# EAGLE design Protoboard (EAGLE 6.5.0)
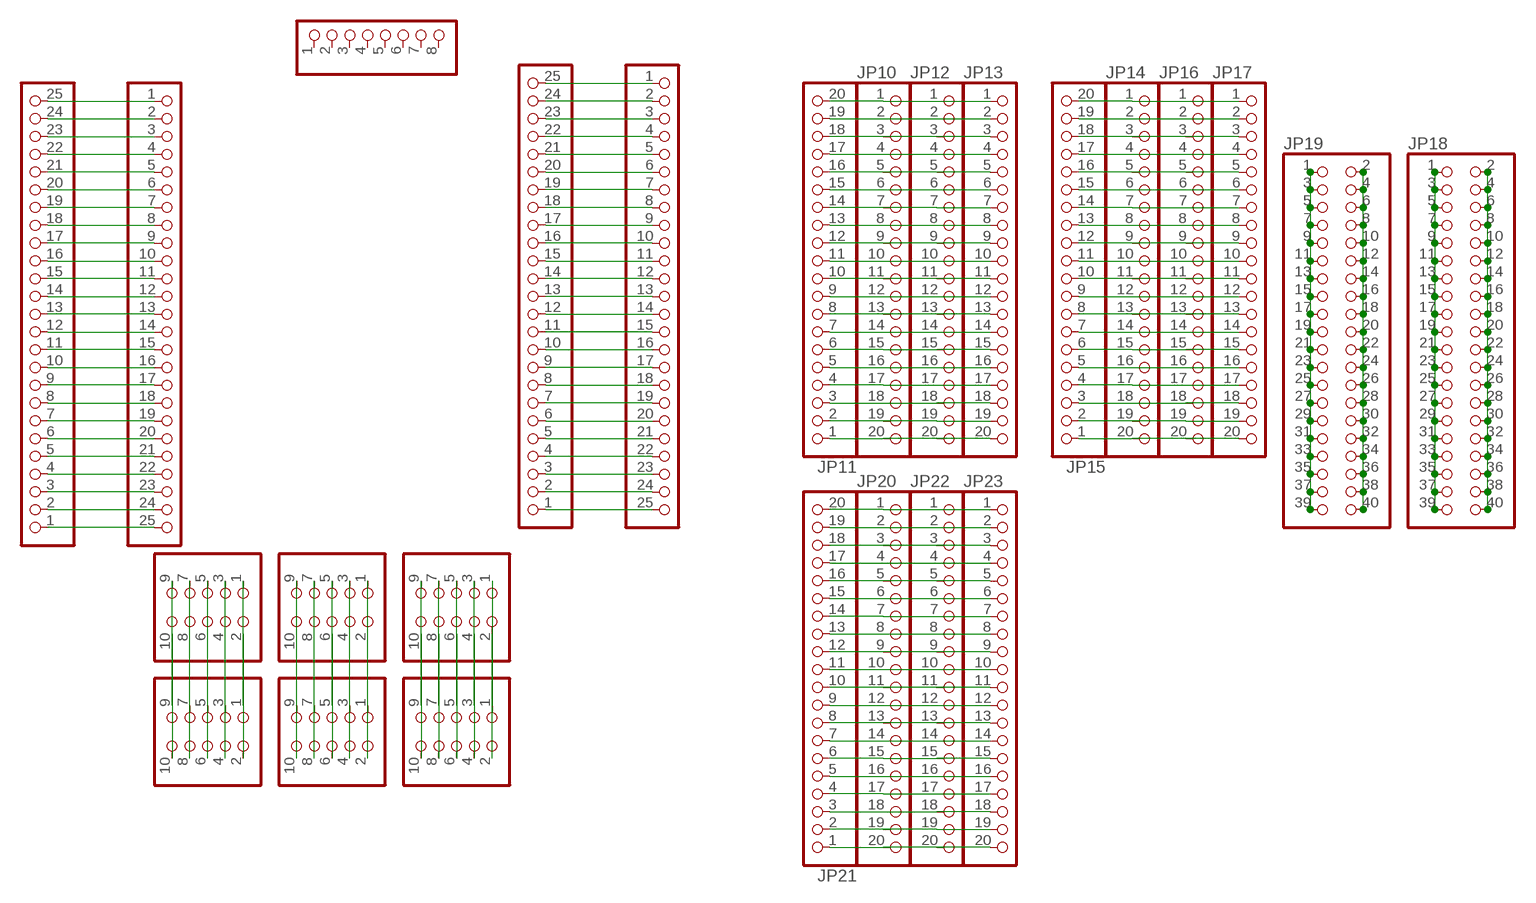
[diagram p0: schematic, sheet 1]

## Parts
GYH  PINHD-1X25  [1X25]
GYH1  PINHD-1X25  [1X25]
JP1  PINHD-1X25  [1X25]
JP2  PINHD-1X25  [1X25]
JP3  PINHD-1X8  [1X08]
JP4  PINHD-2X5/90  [2X05/90]
JP5  PINHD-2X5/90  [2X05/90]
JP6  PINHD-2X5/90  [2X05/90]
JP7  PINHD-2X5  [2X05]
JP8  PINHD-2X5  [2X05]
JP9  PINHD-2X5  [2X05]
JP10  PINHD-1X20  [1X20]
JP11  PINHD-1X20  [1X20]
JP12  PINHD-1X20  [1X20]
JP13  PINHD-1X20  [1X20]
JP14  PINHD-1X20  [1X20]
JP15  PINHD-1X20  [1X20]
JP16  PINHD-1X20  [1X20]
JP17  PINHD-1X20  [1X20]
JP18  PINHD-2X20  [2X20]
JP19  PINHD-2X20  [2X20]
JP20  PINHD-1X20  [1X20]
JP21  PINHD-1X20  [1X20]
JP22  PINHD-1X20  [1X20]
JP23  PINHD-1X20  [1X20]

## Nets
N$1: GYH1.1 GYH.25
N$2: GYH1.2 GYH.24
N$3: GYH1.3 GYH.23
N$4: GYH1.4 GYH.22
N$5: GYH1.5 GYH.21
N$6: GYH1.6 GYH.20
N$7: JP1.25 JP2.1
N$8: JP1.24 JP2.2
N$9: JP1.23 JP2.3
N$10: JP1.22 JP2.4
N$11: JP1.21 JP2.5
N$12: JP1.19 JP2.7
N$13: GYH1.7 GYH.19
N$14: GYH1.8 GYH.18
N$15: GYH1.9 GYH.17
N$16: GYH1.10 GYH.16
N$17: GYH1.11 GYH.15
N$18: GYH1.12 GYH.14
N$19: GYH1.13 GYH.13
N$20: GYH1.14 GYH.12
N$21: GYH1.15 GYH.11
N$22: GYH1.16 GYH.10
N$23: GYH1.17 GYH.9
N$24: GYH1.18 GYH.8
N$25: GYH1.19 GYH.7
N$26: GYH1.20 GYH.6
N$27: GYH1.21 GYH.5
N$28: GYH1.22 GYH.4
N$29: GYH1.23 GYH.3
N$30: GYH1.24 GYH.2
N$31: GYH1.25 GYH.1
N$32: JP1.20 JP2.6
N$33: JP1.18 JP2.8
N$34: JP1.17 JP2.9
N$35: JP1.16 JP2.10
N$36: JP1.15 JP2.11
N$37: JP1.14 JP2.12
N$38: JP1.13 JP2.13
N$39: JP1.12 JP2.14
N$40: JP1.11 JP2.15
N$41: JP1.10 JP2.16
N$42: JP1.9 JP2.17
N$43: JP1.8 JP2.18
N$44: JP1.7 JP2.19
N$45: JP1.6 JP2.20
N$46: JP1.5 JP2.21
N$47: JP1.4 JP2.22
N$48: JP1.3 JP2.23
N$49: JP1.2 JP2.24
N$50: JP1.1 JP2.25
N$51: JP4.1 JP7.1
N$52: JP4.2 JP7.2
N$53: JP4.3 JP7.3
N$54: JP4.4 JP7.4
N$55: JP4.5 JP7.5
N$56: JP4.6 JP7.6
N$57: JP4.7 JP7.7
N$58: JP4.8 JP7.8
N$59: JP4.9 JP7.9
N$60: JP4.10 JP7.10
N$61: JP5.1 JP8.1
N$62: JP5.2 JP8.2
N$63: JP5.3 JP8.3
N$64: JP5.4 JP8.4
N$65: JP5.5 JP8.5
N$66: JP5.6 JP8.6
N$67: JP5.7 JP8.7
N$68: JP5.8 JP8.8
N$69: JP5.9 JP8.9
N$70: JP5.10 JP8.10
N$71: JP6.1 JP9.1
N$72: JP6.2 JP9.2
N$73: JP6.3 JP9.3
N$74: JP6.4 JP9.4
N$75: JP6.5 JP9.5
N$76: JP6.6 JP9.6
N$77: JP6.7 JP9.7
N$78: JP6.8 JP9.8
N$79: JP6.9 JP9.9
N$80: JP6.10 JP9.10
N$81: JP10.1 JP11.20 JP12.1 JP13.1
N$82: JP10.2 JP11.19 JP12.2 JP13.2
N$83: JP10.3 JP11.18 JP12.3 JP13.3
N$84: JP10.4 JP11.17 JP12.4 JP13.4
N$85: JP10.5 JP11.16 JP12.5 JP13.5
N$86: JP10.6 JP11.15 JP12.6 JP13.6
N$87: JP10.7 JP11.14
N$88: JP10.8 JP11.13 JP12.8 JP13.8
N$89: JP10.9 JP11.12 JP12.9 JP13.9
N$90: JP10.10 JP11.11 JP12.10 JP13.10
N$91: JP10.11 JP11.10 JP12.11 JP13.11
N$92: JP10.12 JP11.9 JP12.12 JP13.12
N$93: JP10.13 JP11.8 JP12.13 JP13.13
N$94: JP10.14 JP11.7 JP12.14 JP13.14
N$95: JP10.15 JP11.6 JP12.15 JP13.15
N$96: JP10.16 JP11.5 JP12.16 JP13.16
N$97: JP10.17 JP11.4 JP12.17 JP13.17
N$98: JP10.18 JP11.3 JP12.18 JP13.18
N$99: JP10.19 JP11.2 JP12.19 JP13.19
N$100: JP12.7 JP13.7
N$101: JP14.1 JP15.20 JP16.1 JP17.1
N$102: JP10.20 JP11.1 JP12.20 JP13.20
N$103: JP14.2 JP15.19 JP16.2 JP17.2
N$104: JP14.3 JP15.18 JP16.3 JP17.3
N$105: JP14.4 JP15.17 JP16.4 JP17.4
N$106: JP14.5 JP15.16 JP16.5 JP17.5
N$107: JP14.6 JP15.15 JP16.6 JP17.6
N$108: JP14.7 JP15.14 JP16.7 JP17.7
N$109: JP14.8 JP15.13 JP16.8 JP17.8
N$110: JP14.9 JP15.12 JP16.9 JP17.9
N$111: JP14.10 JP15.11 JP16.10 JP17.10
N$112: JP14.11 JP15.10 JP16.11 JP17.11
N$113: JP14.12 JP15.9 JP16.12 JP17.12
N$114: JP14.13 JP15.8 JP16.13 JP17.13
N$115: JP14.14 JP15.7 JP16.14 JP17.14
N$116: JP14.15 JP15.6 JP16.15 JP17.15
N$117: JP14.16 JP15.5 JP16.16 JP17.16
N$118: JP14.17 JP15.4 JP16.17 JP17.17
N$119: JP14.18 JP15.3 JP16.18 JP17.18
N$120: JP14.19 JP15.2 JP16.19 JP17.19
N$121: JP14.20 JP15.1 JP16.20 JP17.20
N$122: JP18.1 JP18.3 JP18.5 JP18.7 JP18.9 JP18.11 JP18.13 JP18.15 JP18.17 JP18.19 JP18.21 JP18.23 JP18.25 JP18.27 JP18.29 JP18.31 JP18.33 JP18.35 JP18.37 JP18.39
N$123: JP18.2 JP18.4 JP18.6 JP18.8 JP18.10 JP18.12 JP18.14 JP18.16 JP18.18 JP18.20 JP18.22 JP18.24 JP18.26 JP18.28 JP18.30 JP18.32 JP18.34 JP18.36 JP18.38 JP18.40
N$124: JP19.1 JP19.3 JP19.5 JP19.7 JP19.9 JP19.11 JP19.13 JP19.15 JP19.17 JP19.19 JP19.21 JP19.23 JP19.25 JP19.27 JP19.29 JP19.31 JP19.33 JP19.35 JP19.37 JP19.39
N$125: JP19.2 JP19.4 JP19.6 JP19.8 JP19.10 JP19.12 JP19.14 JP19.16 JP19.18 JP19.20 JP19.22 JP19.24 JP19.26 JP19.28 JP19.30 JP19.32 JP19.34 JP19.36 JP19.38 JP19.40
N$126: JP20.1 JP21.20 JP22.1 JP23.1
N$127: JP20.2 JP21.19 JP22.2 JP23.2
N$128: JP20.3 JP21.18 JP22.3 JP23.3
N$129: JP20.4 JP21.17 JP22.4 JP23.4
N$130: JP20.5 JP21.16 JP22.5 JP23.5
N$131: JP20.6 JP21.15 JP22.6 JP23.6
N$132: JP20.7 JP21.14 JP22.7 JP23.7
N$133: JP20.8 JP21.13 JP22.8 JP23.8
N$134: JP20.9 JP21.12 JP22.9 JP23.9
N$135: JP20.10 JP21.11 JP22.10 JP23.10
N$136: JP20.11 JP21.10 JP22.11 JP23.11
N$137: JP20.12 JP21.9 JP22.12 JP23.12
N$138: JP20.13 JP21.8 JP22.13 JP23.13
N$139: JP20.14 JP21.7 JP22.14 JP23.14
N$140: JP20.15 JP21.6 JP22.15 JP23.15
N$141: JP20.16 JP21.5 JP22.16 JP23.16
N$142: JP20.17 JP21.4 JP22.17 JP23.17
N$143: JP20.18 JP21.3 JP22.18 JP23.18
N$144: JP20.19 JP21.2 JP22.19 JP23.19
N$145: JP20.20 JP21.1 JP22.20 JP23.20
Unconnected: JP3.1 JP3.2 JP3.3 JP3.4 JP3.5 JP3.6 JP3.7 JP3.8

## Library data of the parts
GYH GYH1 JP1 JP2 = pinhead:PINHD-1X25: PIN HEADER
JP3 = pinhead:PINHD-1X8: PIN HEADER
JP4-JP9 = pinhead:PINHD-2X5: PIN HEADER
JP10-JP17 JP20-JP23 = pinhead:PINHD-1X20: PIN HEADER
JP18 JP19 = pinhead:PINHD-2X20: PIN HEADER

## Board
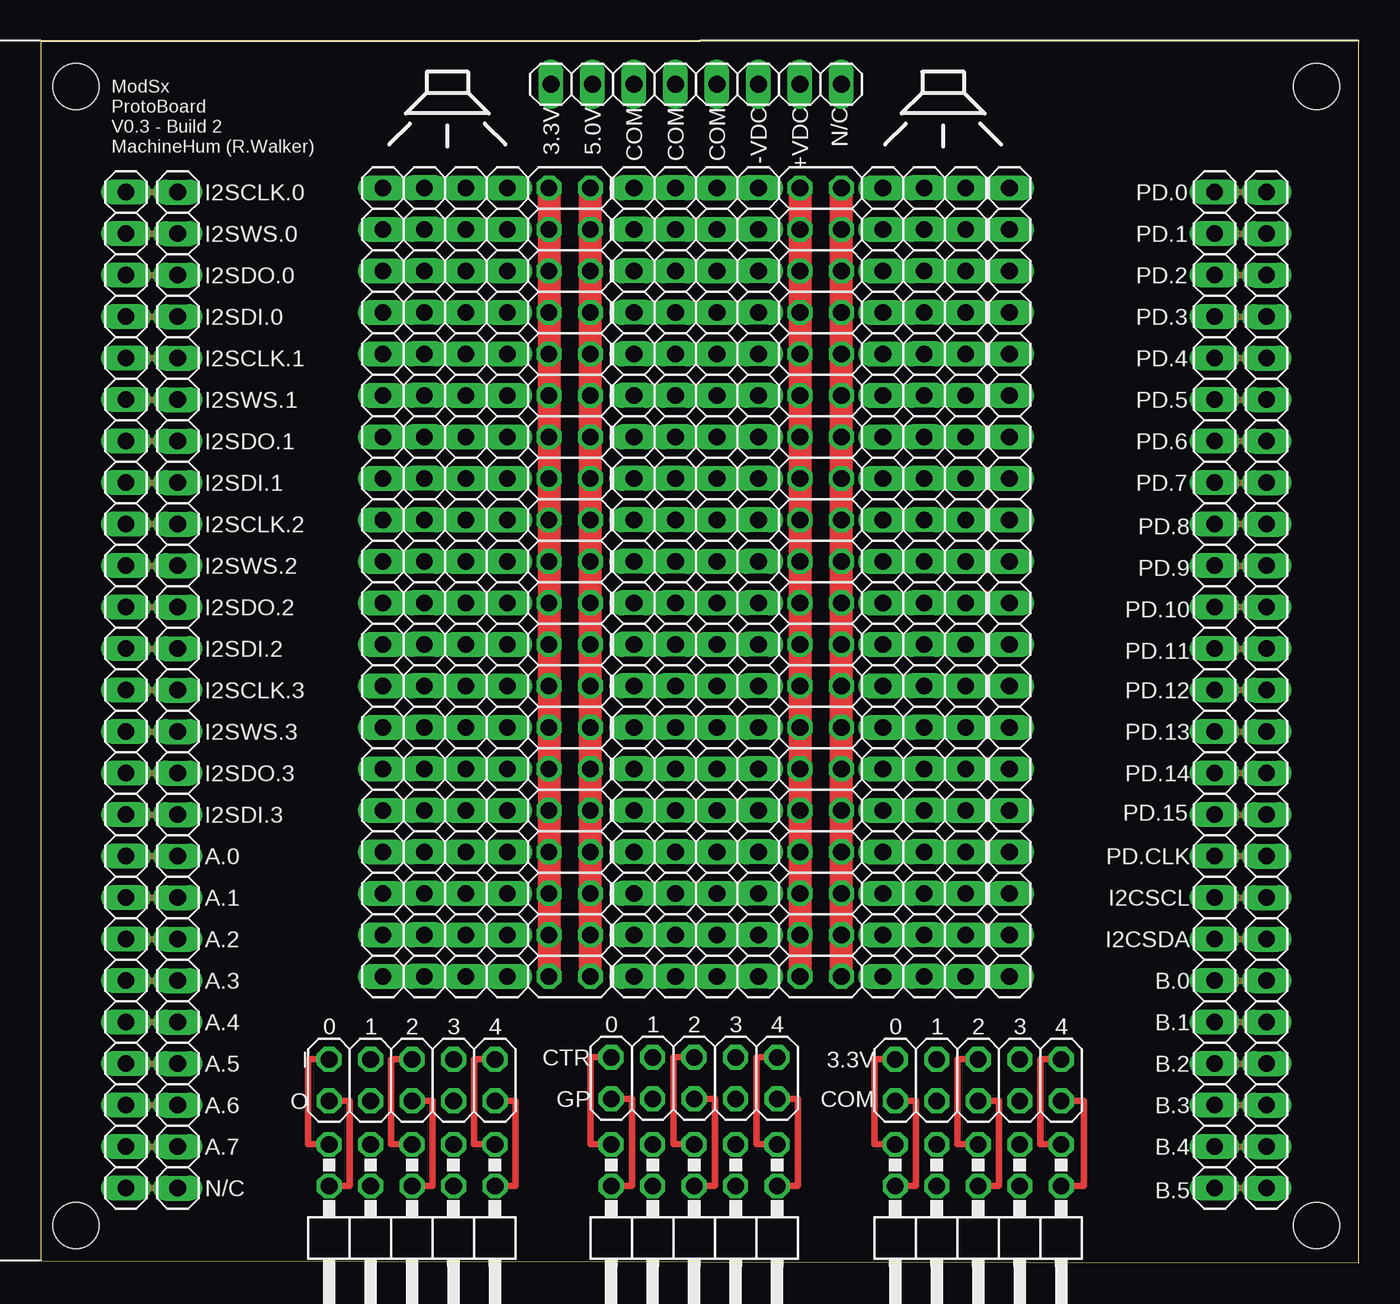
[diagram p1: board, top side]
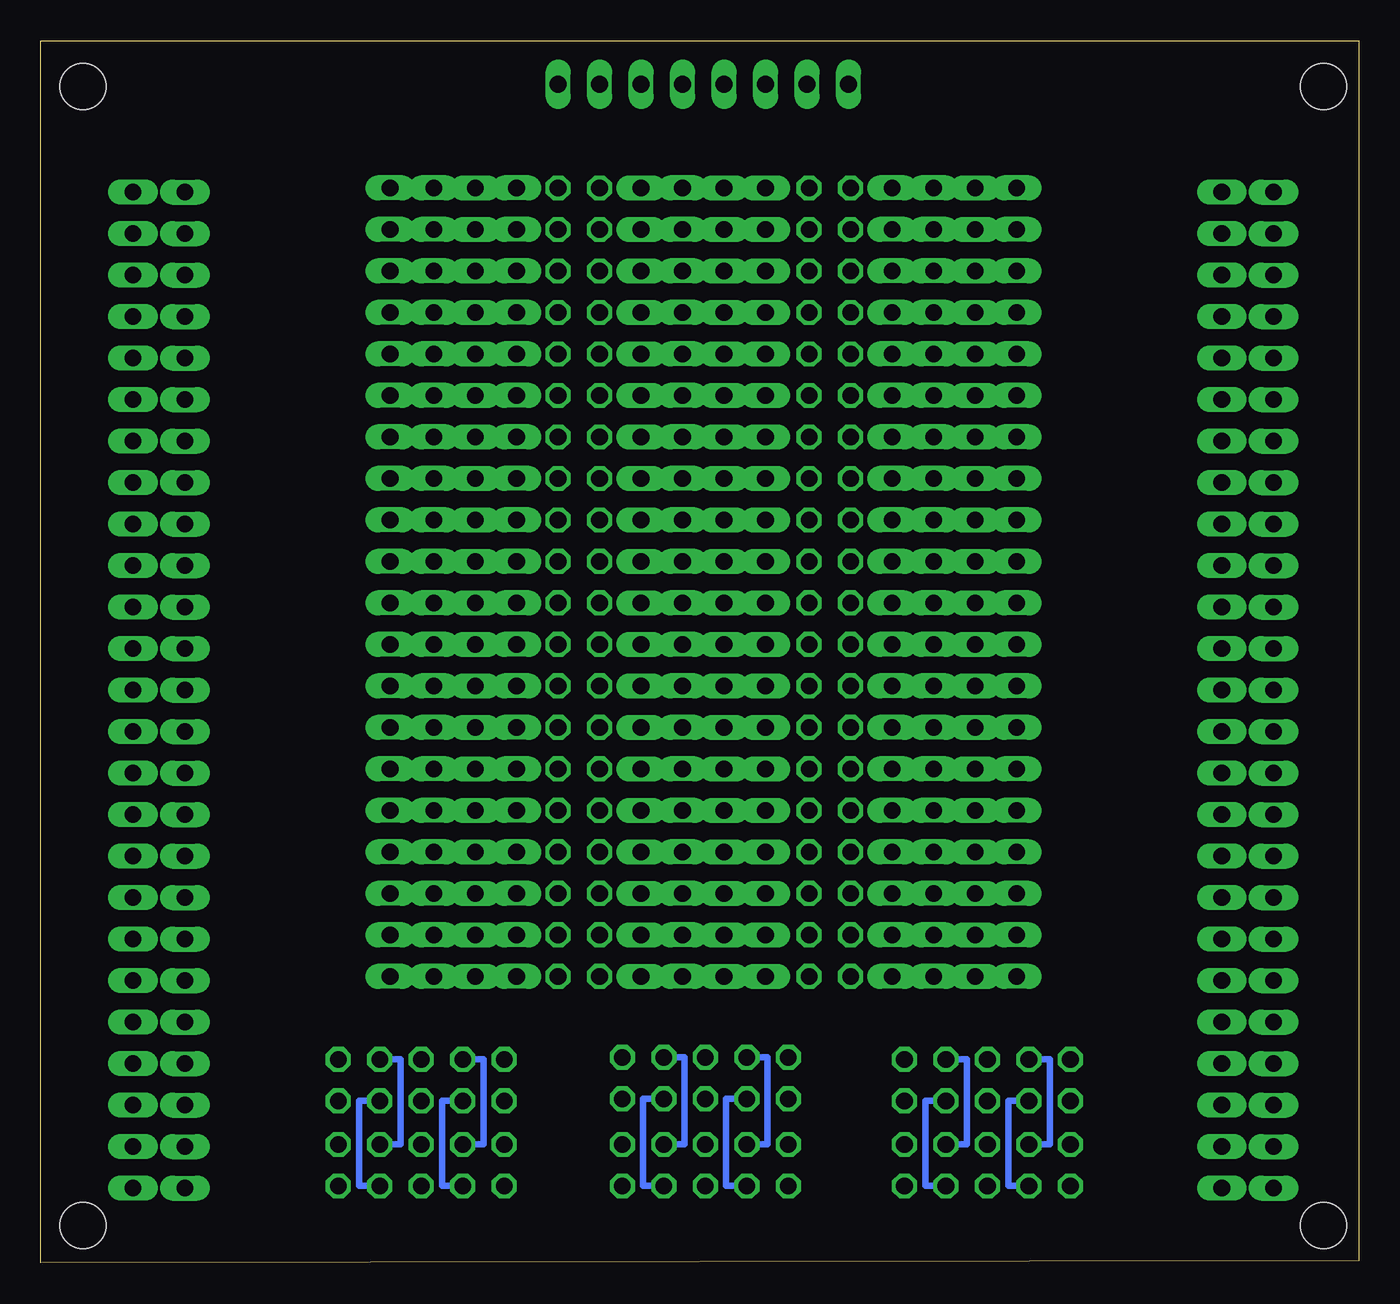
[diagram p2: board, bottom side, seen from below]

Size 80.7 x 74.79 mm. Coordinates in mm from the lower left corner, seen from the top.
Outline: 0,0.13 80.7,0 80.7,74.79 0,74.79 0,0.13
Copper layers (1*16): Top 0.035mm / dielectric 1.5mm / Bottom 0.035mm
Design rules "default": minimum track width 10mil, minimum drill 24mil, track to track 8mil, track to pad 8mil, pad to pad 8mil, via to via 8mil, smd to smd 8mil, copper to edge 40mil, drill to drill 8mil, minimum pad ring 10mil, minimum via ring 8mil, stop-mask expansion 4mil, vias tented up to drill 0mil, thermal gap 10mil
Holes 2.8 mm at 2.16,72.01 2.16,2.29 78.11,72.01 78.11,2.29

### Footprints (pad centres in the part's own frame; a part is rotated, then mirrored left to right if it is on the bottom)
1X25 = drill 1.016 long: 1 -29.21,0; 2 -26.67,0; 3 -24.13,0; 4 -21.59,0; 5 -19.05,0; 6 -16.51,0; 7 -13.97,0; 8 -11.43,0; 9 -8.89,0; 10 -6.35,0; 11 -3.81,0; 12 -1.27,0; 13 1.27,0; 14 3.81,0; 15 6.35,0; 16 8.89,0; 17 11.43,0; 18 13.97,0; 19 16.51,0; 20 19.05,0; 21 21.59,0; 22 24.13,0; 23 26.67,0; 24 29.21,0; 25 31.75,0
1X08 = drill 1.016 long: 1 -8.89,0; 2 -6.35,0; 3 -3.81,0; 4 -1.27,0; 5 1.27,0; 6 3.81,0; 7 6.35,0; 8 8.89,0
2X05/90 = drill 1.016 octagon: 1 -5.08,-6.35; 2 -5.08,-3.81; 3 -2.54,-6.35; 4 -2.54,-3.81; 5 0,-6.35; 6 0,-3.81; 7 2.54,-6.35; 8 2.54,-3.81; 9 5.08,-6.35; 10 5.08,-3.81
2X05 = drill 1.016 octagon: 1 -5.08,-1.27; 2 -5.08,1.27; 3 -2.54,-1.27; 4 -2.54,1.27; 5 0,-1.27; 6 0,1.27; 7 2.54,-1.27; 8 2.54,1.27; 9 5.08,-1.27; 10 5.08,1.27
1X20 = drill 1.016 long: 1 -24.13,0; 2 -21.59,0; 3 -19.05,0; 4 -16.51,0; 5 -13.97,0; 6 -11.43,0; 7 -8.89,0; 8 -6.35,0; 9 -3.81,0; 10 -1.27,0; 11 1.27,0; 12 3.81,0; 13 6.35,0; 14 8.89,0; 15 11.43,0; 16 13.97,0; 17 16.51,0; 18 19.05,0; 19 21.59,0; 20 24.13,0
2X20 = drill 1.016 octagon: 1 -24.13,-1.27; 2 -24.13,1.27; 3 -21.59,-1.27; 4 -21.59,1.27; 5 -19.05,-1.27; 6 -19.05,1.27; 7 -16.51,-1.27; 8 -16.51,1.27; 9 -13.97,-1.27; 10 -13.97,1.27; 11 -11.43,-1.27; 12 -11.43,1.27; 13 -8.89,-1.27; 14 -8.89,1.27; 15 -6.35,-1.27; 16 -6.35,1.27; 17 -3.81,-1.27; 18 -3.81,1.27; 19 -1.27,-1.27; 20 -1.27,1.27; 21 1.27,-1.27; 22 1.27,1.27; 23 3.81,-1.27; 24 3.81,1.27; 25 6.35,-1.27; 26 6.35,1.27; 27 8.89,-1.27; 28 8.89,1.27; 29 11.43,-1.27; 30 11.43,1.27; 31 13.97,-1.27; 32 13.97,1.27; 33 16.51,-1.27; 34 16.51,1.27; 35 19.05,-1.27; 36 19.05,1.27; 37 21.59,-1.27; 38 21.59,1.27; 39 24.13,-1.27; 40 24.13,1.27

### Placement (x,y rotation side)
GYH  8.38,36.32 270 top
GYH1  5.21,33.78 90 top
JP1  71.88,33.78 90 top
JP2  75.06,36.32 270 top
JP3  40.13,72.14 0 top
JP4  40.01,0.89 180 top
JP5  57.4,0.89 180 top
JP6  22.73,0.89 180 top
JP7  40.01,11.3 180 top
JP8  57.4,11.18 180 top
JP9  22.73,11.18 180 top
JP10  20.95,41.66 270 top
JP11  23.5,41.66 90 top
JP12  26.04,41.66 270 top
JP13  28.57,41.66 270 top
JP14  43.94,41.66 90 top
JP15  41.4,41.66 270 top
JP16  36.32,41.66 90 top
JP17  38.86,41.66 90 top
JP18  32.38,41.66 270 top
JP19  47.75,41.66 90 top
JP20  51.56,41.66 270 top
JP21  54.1,41.66 90 top
JP22  56.64,41.66 270 top
JP23  59.31,41.66 270 top

### Tracks (layer width: path | path; a pad name or v marks a point on that pad's centre or on a via)
N$1
  Top 0.406: GYH.25 GYH1.1
N$2
  Top 0.406: GYH1.2 GYH.24
N$3
  Top 0.406: GYH.23 GYH1.3
N$4
  Top 0.406: GYH1.4 GYH.22
N$5
  Top 0.406: GYH.21 GYH1.5
N$6
  Top 0.406: GYH1.6 GYH.20
N$7
  Top 0.406: JP2.1 JP1.25
N$8
  Top 0.406: JP1.24 JP2.2
N$9
  Top 0.406: JP1.23 JP2.3
N$10
  Top 0.406: JP2.4 JP1.22
N$11
  Top 0.406: JP1.21 JP2.5
N$12
  Top 0.406: JP1.19 JP2.7
N$13
  Top 0.406: GYH.19 GYH1.7
N$14
  Top 0.406: GYH1.8 GYH.18
N$15
  Top 0.406: GYH.17 GYH1.9
N$16
  Top 0.406: GYH1.10 GYH.16
N$17
  Top 0.406: GYH.15 GYH1.11
N$18
  Top 0.406: GYH1.12 GYH.14
N$19
  Top 0.406: GYH.13 GYH1.13
N$20
  Top 0.406: GYH1.14 GYH.12
N$21
  Top 0.406: GYH.11 GYH1.15
N$22
  Top 0.406: GYH.10 GYH1.16
N$23
  Top 0.406: GYH1.17 GYH.9
N$24
  Top 0.406: GYH1.18 GYH.8
N$25
  Top 0.406: GYH.7 GYH1.19
N$26
  Top 0.406: GYH1.20 GYH.6
N$27
  Top 0.406: GYH.5 GYH1.21
N$28
  Top 0.406: GYH1.22 GYH.4
N$29
  Top 0.406: GYH.3 GYH1.23
N$30
  Top 0.406: GYH1.24 GYH.2
N$31
  Top 0.406: GYH.1 GYH1.25
N$32
  Top 0.406: JP2.6 JP1.20
N$33
  Top 0.406: JP1.18 JP2.8
N$34
  Top 0.406: JP2.9 JP1.17
N$35
  Top 0.406: JP1.16 JP2.10
N$36
  Top 0.406: JP2.11 JP1.15
N$37
  Top 0.406: JP1.14 JP2.12
N$38
  Top 0.406: JP2.13 JP1.13
N$39
  Top 0.406: JP2.14 JP1.12
N$40
  Top 0.406: JP1.11 JP2.15
N$41
  Top 0.406: JP2.16 JP1.10
N$42
  Top 0.406: JP1.9 JP2.17
N$43
  Top 0.406: JP2.18 JP1.8
N$44
  Top 0.406: JP1.7 JP2.19
N$45
  Top 0.406: JP1.6 JP2.20
N$46
  Top 0.406: JP2.21 JP1.5
N$47
  Top 0.406: JP1.4 JP2.22
N$48
  Top 0.406: JP2.23 JP1.3
N$49
  Top 0.406: JP1.2 JP2.24
N$50
  Top 0.406: JP2.25 JP1.1
N$51
  Top 0.406: JP7.1 43.81,12.57 43.81,7.24 JP4.1
N$52
  Top 0.406: JP7.2 46.35,10.03 46.35,4.7 JP4.2
N$53
  Bottom 0.406: JP7.3 41.27,12.57 41.27,7.24 JP4.3
N$54
  Bottom 0.406: JP7.4 43.81,10.03 43.81,4.7 JP4.4
N$55
  Top 0.406: JP7.5 38.73,12.57 38.73,7.24 JP4.5
N$56
  Top 0.406: JP7.6 41.27,10.03 41.27,4.7 JP4.6
N$57
  Bottom 0.406: JP7.7 36.2,12.57 36.2,7.24 JP4.7
N$58
  Bottom 0.406: JP7.8 38.73,10.03 38.73,4.7 JP4.8
N$59
  Top 0.406: JP7.9 33.66,12.57 33.66,7.24 JP4.9
N$60
  Top 0.406: JP7.10 36.2,10.03 36.2,4.7 JP4.10
N$61
  Top 0.406: JP8.1 61.21,12.45 61.21,7.24 JP5.1
N$62
  Top 0.406: JP8.2 63.88,9.91 63.88,4.7 JP5.2
N$63
  Bottom 0.406: JP8.3 58.67,12.45 58.67,7.24 JP5.3
N$64
  Bottom 0.406: JP8.4 61.21,9.91 61.21,4.7 JP5.4
N$65
  Top 0.406: JP8.5 56.13,12.45 56.13,7.24 JP5.5
N$66
  Top 0.406: JP8.6 58.67,9.91 58.67,4.7 JP5.6
N$67
  Bottom 0.406: JP8.7 53.59,12.45 53.59,7.24 JP5.7
N$68
  Bottom 0.406: JP8.8 56.13,9.91 56.13,4.7 JP5.8
N$69
  Top 0.406: JP8.9 51.05,12.45 51.05,7.24 JP5.9
N$70
  Top 0.406: JP8.10 53.59,9.91 53.59,4.7 JP5.10
N$71
  Top 0.406: JP9.1 26.54,12.45 26.54,7.24 JP6.1
N$72
  Top 0.406: JP9.2 29.08,9.91 29.08,4.7 JP6.2
N$73
  Bottom 0.406: JP9.3 24,12.45 24,7.24 JP6.3
N$74
  Bottom 0.406: JP9.4 26.54,9.91 26.54,4.7 JP6.4
N$75
  Top 0.406: JP9.5 21.46,12.45 21.46,7.24 JP6.5
N$76
  Top 0.406: JP9.6 24,9.91 24,4.7 JP6.6
N$77
  Bottom 0.406: JP9.7 18.92,12.45 18.92,7.24 JP6.7
N$78
  Bottom 0.406: JP9.8 21.46,9.91 21.46,4.7 JP6.8
N$79
  Top 0.406: JP9.9 16.38,12.45 16.38,7.24 JP6.9
N$80
  Top 0.406: JP9.10 18.92,9.91 18.92,4.7 JP6.10
N$81
  Top 1.422: JP10.1 JP11.20 JP12.1 JP13.1
N$82
  Top 1.422: JP13.2 JP12.2 JP11.19 JP10.2
N$83
  Top 1.422: JP10.3 JP11.18 JP12.3 JP13.3
N$84
  Top 1.422: JP13.4 JP12.4 JP11.17 JP10.4
N$85
  Top 1.422: JP10.5 JP11.16 JP12.5 JP13.5
N$86
  Top 1.422: JP13.6 JP12.6 JP11.15 JP10.6
N$87
  Top 1.422: JP10.7 JP11.14
N$88
  Top 1.422: JP10.8 JP11.13 JP12.8 JP13.8
N$89
  Top 1.422: JP13.9 JP12.9 JP11.12 JP10.9
N$90
  Top 1.422: JP10.10 JP11.11 JP12.10 JP13.10
N$91
  Top 1.422: JP13.11 JP12.11 JP11.10 JP10.11
N$92
  Top 1.422: JP10.12 JP11.9 JP12.12 JP13.12
N$93
  Top 1.422: JP13.13 JP12.13 JP11.8 JP10.13
N$94
  Top 1.422: JP10.14 JP11.7 JP12.14 JP13.14
N$95
  Top 1.422: JP10.15 JP11.6 JP12.15 JP13.15
N$96
  Top 1.422: JP13.16 JP12.16 JP11.5 JP10.16
N$97
  Top 1.422: JP10.17 JP11.4 JP12.17 JP13.17
N$98
  Top 1.422: JP13.18 JP12.18 JP11.3 JP10.18
N$99
  Top 1.422: JP10.19 JP11.2 JP12.19 JP13.19
N$100
  Top 1.422: 23.5,50.55 JP12.7 JP13.7
N$101
  Top 1.422: JP14.1 JP15.20 JP17.1 JP16.1
N$102
  Top 1.422: JP13.20 JP12.20 JP11.1 JP10.20
N$103
  Top 1.422: JP16.2 JP17.2 JP15.19 JP14.2
N$104
  Top 1.422: JP14.3 JP15.18 JP17.3 JP16.3
N$105
  Top 1.422: JP16.4 JP17.4 JP15.17 JP14.4
N$106
  Top 1.422: JP14.5 JP15.16 JP17.5 JP16.5
N$107
  Top 1.422: JP16.6 JP17.6 JP15.15 JP14.6
N$108
  Top 1.422: JP14.7 JP15.14 JP17.7 JP16.7
N$109
  Top 1.422: JP17.8 JP16.8 JP15.13 JP14.8
N$110
  Top 1.422: JP14.9 JP15.12 JP17.9 JP16.9
N$111
  Top 1.422: JP14.10 JP15.11 JP17.10 JP16.10
N$112
  Top 1.422: JP16.11 JP17.11 JP15.10 JP14.11
N$113
  Top 1.422: JP14.12 JP15.9 JP17.12 JP16.12
N$114
  Top 1.422: JP16.13 JP17.13 JP15.8 JP14.13
N$115
  Top 1.422: JP17.14 JP16.14 JP15.7 JP14.14
N$116
  Top 1.422: JP15.6 JP14.15 JP17.15 JP16.15
N$117
  Top 1.422: JP17.16 JP16.16 JP15.5 JP14.16
N$118
  Top 1.422: JP14.17 JP15.4 JP17.17 JP16.17
N$119
  Top 1.422: JP17.18 JP16.18 JP15.3 JP14.18
N$120
  Top 1.422: JP15.2 JP14.19 JP17.19 JP16.19
N$121
  Top 1.422: JP17.20 JP16.20 JP15.1 JP14.20
N$122
  Top 1.422: JP18.1 JP18.3 JP18.5 JP18.7 JP18.9 JP18.11 JP18.13 JP18.15 JP18.17 JP18.19 JP18.21 JP18.23 JP18.25 JP18.27 JP18.29 JP18.31 JP18.33 JP18.35 JP18.37 JP18.39
N$123
  Top 1.422: JP18.40 JP18.38 JP18.36 JP18.34 JP18.32 JP18.30 JP18.28 JP18.26 JP18.24 JP18.22 JP18.20 JP18.18 JP18.16 JP18.14 JP18.12 JP18.10 JP18.8 JP18.6 JP18.4 JP18.2
N$124
  Top 1.422: JP19.1 JP19.3 JP19.5 JP19.7 JP19.9 JP19.11 JP19.13 JP19.15 JP19.17 JP19.19 JP19.21 JP19.23 JP19.25 JP19.27 JP19.29 JP19.31 JP19.33 JP19.35 JP19.37 JP19.39
N$125
  Top 1.422: JP19.40 JP19.38 JP19.36 JP19.34 JP19.32 JP19.30 JP19.28 JP19.26 JP19.24 JP19.22 JP19.20 JP19.18 JP19.16 JP19.14 JP19.12 JP19.10 JP19.8 JP19.6 JP19.4 JP19.2
N$126
  Top 1.422: JP20.1 JP21.20 JP22.1 JP23.1
N$127
  Top 1.422: JP23.2 JP22.2 JP21.19 JP20.2
N$128
  Top 1.422: JP20.3 JP21.18 JP22.3 JP23.3
N$129
  Top 1.422: JP23.4 JP22.4 | JP22.4 JP21.17 | JP22.4 JP20.4
N$130
  Top 1.422: JP20.5 JP21.16 JP22.5 JP23.5
N$131
  Top 1.422: JP20.6 JP21.15 JP22.6 JP23.6
N$132
  Top 1.422: JP23.7 JP22.7 JP21.14 JP20.7
N$133
  Top 1.422: JP20.8 JP21.13 JP22.8 JP23.8
N$134
  Top 1.422: JP23.9 JP22.9 JP21.12 JP20.9
N$135
  Top 1.422: JP20.10 JP21.11 JP22.10 JP23.10
N$136
  Top 1.422: JP23.11 JP22.11 54.61,40.39 JP21.10 JP20.11
N$137
  Top 1.422: JP20.12 JP21.9 JP22.12 JP23.12
N$138
  Top 1.422: JP20.13 JP21.8 JP22.13 JP23.13
N$139
  Top 1.422: JP20.14 JP21.7 JP22.14 JP23.14
N$140
  Top 1.422: JP20.15 JP21.6 JP22.15 JP23.15
N$141
  Top 1.422: JP20.16 JP21.5 JP22.16 JP23.16
N$142
  Top 1.422: JP23.17 JP22.17 JP21.4 JP20.17
N$143
  Top 1.422: JP20.18 JP21.3 JP22.18 JP23.18
N$144
  Top 1.422: JP23.19 JP22.19 JP21.2 JP20.19
N$145
  Top 1.422: JP21.1 JP20.20 JP22.20 JP23.20

### Text on the board
tPlace: 3.3V | 5.0V | COM | COM | COM | -VDC | +VDC | N/C | ModSx / ProtoBoard / V0.3 - Build 2 / MachineHum (R.Walker) | I2SCLK.0 | PD.0 | I2SWS.0 | PD.1 | I2SDO.0 | PD.2 | I2SDI.0 | PD.3 | I2SCLK.1 | PD.4 | I2SWS.1 | PD.5 | I2SDO.1 | PD.6 | I2SDI.1 | PD.7 | I2SCLK.2 | PD.8 | I2SWS.2 | PD.9 | I2SDO.2 | PD.10 | I2SDI.2 | PD.11 | I2SCLK.3 | PD.12 | I2SWS.3 | PD.13 | I2SDO.3 | PD.14 | I2SDI.3 | PD.15 | A.0 | PD.CLK | A.1 | I2CSCL | A.2 | I2CSDA | A.3 | B.0 | A.4 | 0 | 1 | 2 | 3 | 4 | 0 | 1 | 2 | 3 | 4 | 0 | 1 | 2 | 3 | 4 | B.1 | A.5 | I | CTR | 3.3V | B.2 | A.6 | O | GP | COM | B.3 | A.7 | B.4 | N/C | B.5